# EAGLE schematic counter (EAGLE 9.6.2)
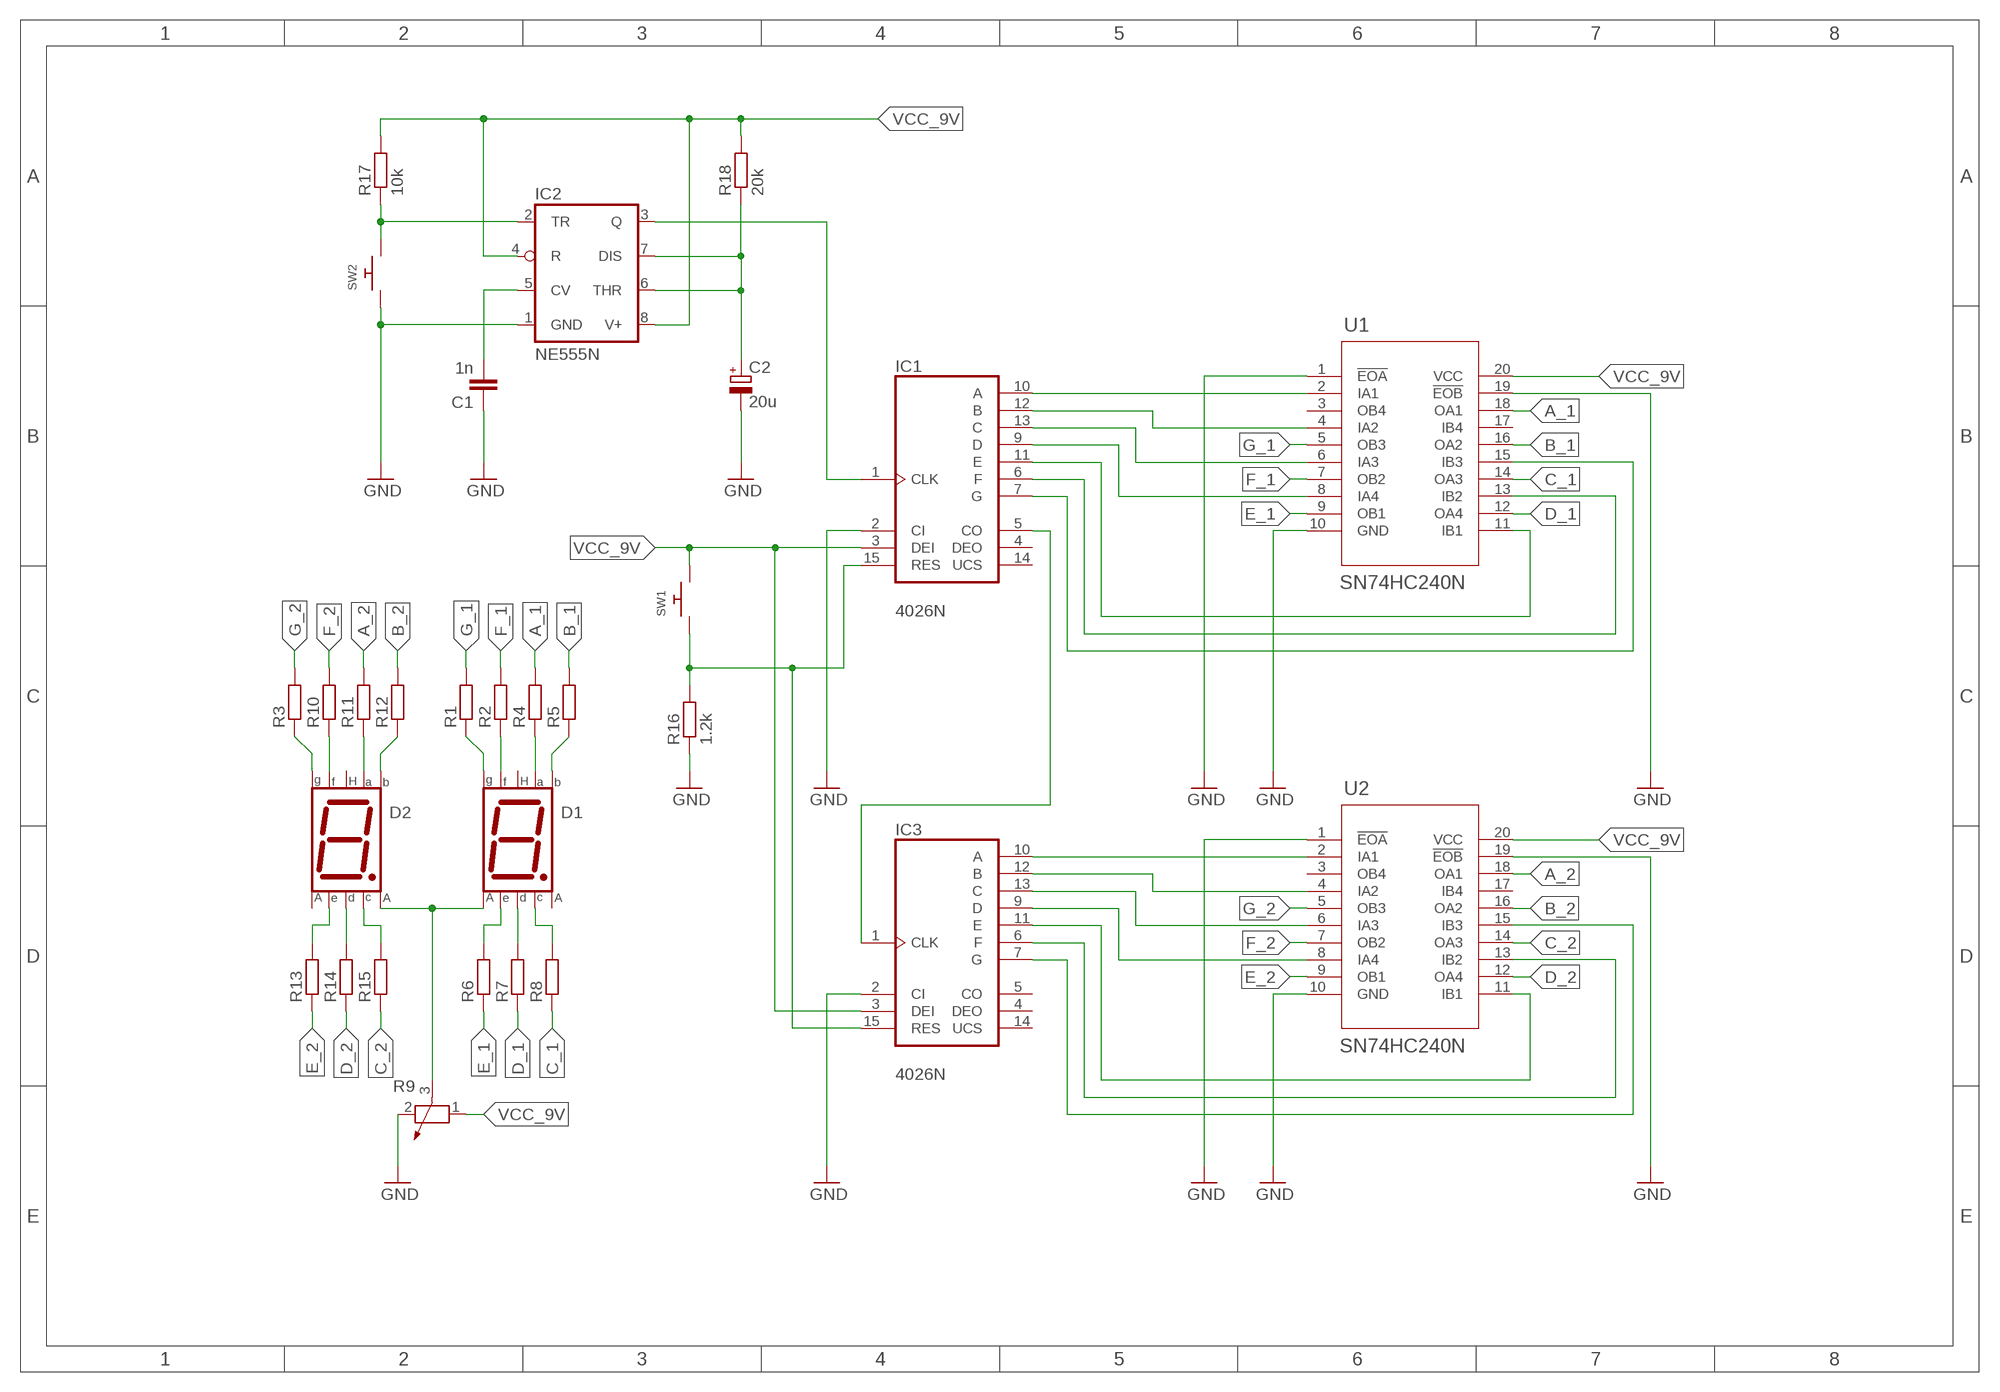
[diagram p0: schematic, sheet 1]

## Parts
C1  1n  C-EU025-024X044  [C025-024X044]
C2  20u  CPOL-EUE5-5  [E5-5]
D1  7SEG-CA  [7SEG-13]
D2  7SEG-CA  [7SEG-13]
IC1  4026N  [DIL16]
IC2  NE555N  [DIL08-ROUND]
IC3  4026N  [DIL16]
R1  R-EU_0204/5  [0204/5]
R2  R-EU_0204/5  [0204/5]
R3  R-EU_0204/5  [0204/5]
R4  R-EU_0204/5  [0204/5]
R5  R-EU_0204/5  [0204/5]
R6  R-EU_0204/5  [0204/5]
R7  R-EU_0204/5  [0204/5]
R8  R-EU_0204/5  [0204/5]
R9  POTENTIOMETER_PT-10  [PT-10]
R10  R-EU_0204/5  [0204/5]
R11  R-EU_0204/5  [0204/5]
R12  R-EU_0204/5  [0204/5]
R13  R-EU_0204/5  [0204/5]
R14  R-EU_0204/5  [0204/5]
R15  R-EU_0204/5  [0204/5]
R16  1.2k  R-EU_0204/5  [0204/5]
R17  10k  R-EU_0204/5  [0204/5]
R18  20k  R-EU_0204/5  [0204/5]
SW1  SWITCH_PUSHBUTTONEVQ-PE  [TACT_PANA-EVQ]
SW2  SWITCH_PUSHBUTTONEVQ-PE  [TACT_PANA-EVQ]
U1  SN74HC240N  [N20]
U2  SN74HC240N  [N20]

## Nets
A_1: U1.18(OA1)
A_2: U2.18(OA1)
B_1: U1.16(OA2)
B_2: U2.16(OA2)
C_1: U1.14(OA3)
C_2: U2.14(OA3)
D_1: U1.12(OA4)
D_2: U2.12(OA4)
E_1: U1.9(OB1)
E_2: U2.9(OB1)
F_1: U1.7(OB2)
F_2: U2.7(OB2)
G_1: U1.5(OB3)
G_2: U2.5(OB3)
GND: C1.1 C2.- IC1.2(CI) IC2.1(GND) IC3.2(CI) R9.2 R16.1 SW2.P$1 U1.1(!EOA) U1.10(GND) U1.19(!EOB) U2.1(!EOA) U2.10(GND) U2.19(!EOB)
N$1: IC1.10(A) U1.2(IA1)
N$2: IC1.12(B) U1.4(IA2)
N$3: IC1.13(C) U1.6(IA3)
N$4: IC1.9(D) U1.8(IA4)
N$5: IC1.11(E) U1.11(IB1)
N$6: IC1.6(F) U1.13(IB2)
N$7: IC1.7(G) U1.15(IB3)
N$8: D1.10(G) R1.1
N$9: D1.9(F) R2.1
N$10: D1.7(A) R4.1
N$11: D2.10(G) R3.1
N$12: D1.6(B) R5.1
N$13: D1.2(D) R7.2
N$14: D1.1(E) R6.2
N$15: D1.4(C) R8.2
N$16: D1.3(CA1) D2.8(CA2) R9.3
N$17: R9.1
N$18: R1.2
N$19: R2.2
N$20: D2.6(B) R12.1
N$21: R4.2
N$22: R5.2
N$23: R8.1
N$24: R7.1
N$25: R6.1
N$26: D2.2(D) R14.2
N$27: D2.1(E) R13.2
N$28: D2.4(C) R15.2
N$29: IC1.3(DEI) IC3.3(DEI) SW1.P$2
N$30: IC1.15(RES) IC3.15(RES) R16.2 SW1.P$1
N$31: R3.2
N$32: R10.2
N$33: R11.2
N$34: R12.2
N$35: R15.1
N$36: R14.1
N$37: R13.1
N$38: D2.9(F) R10.1
N$39: D2.7(A) R11.1
N$40: C2.+ IC2.6(THR) IC2.7(DIS) R18.1
N$41: IC2.2(TR) R17.1 SW2.P$2
N$42: IC1.1(CLK) IC2.3(Q)
N$43: IC3.10(A) U2.2(IA1)
N$44: C1.2 IC2.5(CV)
N$45: IC1.5(CO) IC3.1(CLK)
N$46: IC3.12(B) U2.4(IA2)
N$47: IC3.13(C) U2.6(IA3)
N$48: IC3.9(D) U2.8(IA4)
N$49: IC3.11(E) U2.11(IB1)
N$50: IC3.6(F) U2.13(IB2)
N$51: IC3.7(G) U2.15(IB3)
VCC_9V: IC2.4(R) IC2.8(V+) R17.2 R18.2 U1.20(VCC) U2.20(VCC)
Unconnected: D1.5(DP) D1.8(CA2) D2.3(CA1) D2.5(DP) IC1.4(DEO) IC1.14(UCS) IC3.4(DEO) IC3.5(CO) IC3.14(UCS) U1.3(OB4) U1.17(IB4) U2.3(OB4) U2.17(IB4)

## Power pins joined to a net without a drawn wire
VDD: IC1.16(VDD) IC3.16(VDD)
VSS: IC1.8(VSS) IC3.8(VSS)

## Library data of the parts
C1 = rcl:C-EU: CAPACITOR, European symbol; SPICEPREFIX: C
C2 = rcl:CPOL-EU: POLARIZED CAPACITOR, European symbol; SPICEPREFIX: C
D1 D2 = 7SEG-vertical(CHINA):7SEG-CA: 7-segment DISPLAY single anode, 13 mm
IC1 IC3 = 40xx:4026: Decade COUNTER/DIVIDER, 7-seg. outputs
IC2 = adafruit:*555: TIMER Changed DIP package to have round (not oval) pin pads http://www.ladyada.net/library/pcb/eaglelibrary.html
R1-R8 R10-R18 = rcl:R-EU_: RESISTOR, European symbol; SPICEPREFIX: R
R9 = rcl:POTENTIOMETER_: Potentiometer; SPICEMODEL: POT; SPICEPREFIX: X
SW1 SW2 = arduino_UNO_edit:SWITCH_PUSHBUTTON: Buttons SOFTTOUCHSMD_SJ - Soft touch temporary push button (Super Junk Akihabara) Compatible with SKPMANE010 [Mouser: 688-SKPMAN] C&K_KSS = Digikey: KSS221GLFS
U1 U2 = SN74HC240N:SN74HC240N; COPYRIGHT: Copyright (C) 2022 Ultra Librarian. All rights reserved.; MANUFACTURER_PART_NUMBER: SN74HC240N; MFR_NAME: Texas Instruments

## Module HEF
Ports: 

### Library data of the parts